# Altium schematic sheet STEP_DOWN.SchDoc: =DocumentName
size A4; ENG_APP_DATE: --/--/--; DSN_APP_DATE: --/--/--; CHK_APP_DATE: --/--/--; CompanyName: "AS Manufacturing" LLC; Organization: "AS Manufacturing" LLC; Address1: 5 Sklyarenka St.; Address2: Kyiv 04073; Address3: Ukraine; Address4: https://ajax.systems/en/; SheetNumber: 2; SheetTotal: 10; Template_version: 1.0.1
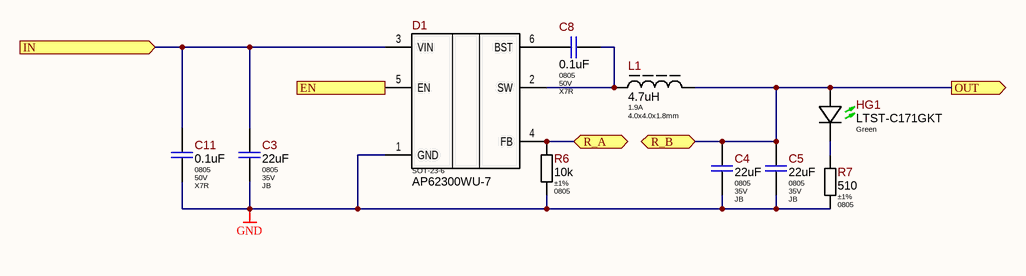
[diagram p0: STEP_DOWN.SchDoc]

## Parts
C3  Package: 0805  Voltage: 35V  Dielectric Type: JB  [CAP-0805(2012)X125T20]  (hidden comment: 22uF)
C4  Package: 0805  Voltage: 35V  Dielectric Type: JB  [CAP-0805(2012)X125T20]  (hidden comment: 22uF)
C5  Package: 0805  Voltage: 35V  Dielectric Type: JB  [CAP-0805(2012)X125T20]  (hidden comment: 22uF)
C8  Package: 0805  Voltage: 50V  Dielectric Type: X7R  [CAP-0805(2012)X85T10]  (hidden comment: 0.1uF)
C11  Package: 0805  Voltage: 50V  Dielectric Type: X7R  [CAP-0805(2012)X85T10]  (hidden comment: 0.1uF)
D1  AP62300WU-7  [SOT-23-6]
HG1  Color: Green  [LTST-C171GKT]  (hidden comment: LTST-C171GKT)
L1  Current: 1.9A  Package: 4.0x4.0x1.8mm  [SRN4018-Series_1.8mm]  (hidden comment: 4.7uH)
R6  Tolerance: ±1%  Package: 0805  [R_ANY_CHIP_0805_MED]  (hidden comment: 10k)
R7  Tolerance: ±1%  Package: 0805  [R_ANY_CHIP_0805_MED]  (hidden comment: 510)

## Ports
EN (in), IN (in), OUT (out), R_A (bidir), R_B (bidir)

## Nets
GND: C3.2 C4.2 C5.2 C11.2 D1.1(GND) R6.2 R7.2
EN: D1.5(EN) ; port EN
IN: C3.1 C11.1 D1.3(VIN) ; port IN
OUT: C4.1 C5.1 HG1.AN(Anode) L1.2 ; port OUT, port R_B
R_A: D1.4(FB) R6.1 ; port R_A
NetC8_1: C8.1 D1.6(BST)
NetC8_2: C8.2 D1.2(SW) L1.1
NetHG1_CA: HG1.CA(Cathode) R7.1

## Notes on the sheet
- Title
- Product:
- Project:
- Size:
- Date:
- Variant:
- A4
- Authors:
- Time:
- Sheet
- of
- Revision:
- @Vitech_ua
- Commit:

## Library data of the parts
C3-C5 = C2012JB1V226M125AC: 22uF 35V JB ±20% 0805 Ceramic Capacitor RoHS; Manufacturer: TDK Corporation; Ajax_1C_ID: 32073; Ajax_1C_PN: 22uF 35V 20% 0805 TDK C2012JB1V226M125AC Ceramic Capacitors RoHS; Ajax_1С_Status: RND Only; Standard Lead Time: 30 Weeks; Component Status: Released; Replacement: NONE; GUID_1C: 562d6396-e930-11eb-ab74-0050569f2651; Value: 22uF; Part Number: C2012JB1V226M125AC; Part Type: Ceramic / JB / 0805; Component Type: SMD; Temperature Range: -25°C ~ 85°C; Tolerance: ±20%; ComponentLink1URL: https://product.tdk.com/info/en/catalog/datasheets/mlcc_commercial_general_en.pdf; Supplier 1: Mouser; Supplier Part Number 1: 810-C2012JB1V226M12C; Price: 0,567; ComponentLink1Description: Datasheet
C8 C11 = CL21B104KBCNNNC: 100nF 50V X7R ±10% 0805 Ceramic Capacitor RoHS; Manufacturer: Samsung Electro-Mechanics; Ajax_1C_ID: 1251; Ajax_1C_PN: 100nF 50V X7R 10% 0805 CL21B104KBCNNNC Ceramic Capacitor SMD RoHS; Ajax_1С_Status: Mass Production; Standard Lead Time: 22 Weeks; Component Status: Released; Replacement: NONE; GUID_1C: 2c368b99-dd41-11e0-af93-6c626deda1bb; Value: 0.1uF; Part Number: CL21B104KBCNNNC; Part Type: Ceramic / X7R / 0805; Component Type: SMD; Temperature Range: -55°C ~ 125°C; Tolerance: ±10%; ComponentLink1URL: https://media.digikey.com/pdf/Data%20Sheets/Samsung%20PDFs/CL_Series_MLCC_ds.pdf; Supplier 1: Digi-Key; Supplier Part Number 1: 1276-1003-2-ND; Price: 0,00700031; ComponentLink1Description: Datasheet
D1 = AP62300WU-7: 4.35V to 18V, 2A, High Efficiency Synchronous Step Down Converter, 500kHz, SOT-23-6; Manufacturer: Diodes Incorporated; Ajax_1С_Status: RND Only; Component Status: Released; Replacement: NONE; Part Type: Power / DC-DC / Buck; Component Type: SMD; Temperature Range: -40°C ~ 85°C; ComponentLink1Description: Datasheet; Package: SOT-23-6; Part Number: AP62300WU-7
HG1 = LTST-C171GKT: Low Power LED, Green 565nm, Clear, SMD 0805, Vf 2.1V - 2.6V, 5 ~ 12mcd @ 20 mA, 130°; Manufacturer: Lite-On Optoelectronics; Ajax_1C_ID: 30364; Ajax_1C_PN: LTST-C171GKT Green SMD LED 0805 12mcd 20mA 130deg RoHS; Ajax_1С_Status: RND Only; Component Status: Released; Replacement: NONE; GUID_1C: df39881f-c399-11eb-ab74-0050569f2651; Part Number: LTST-C171GKT; Part Type: LED / 0805; Component Type: SMD; Package: 0805; Wavelength: 565nm; Temperature Range: -55°C ~ 85°C; ComponentLink1URL: https://media.digikey.com/pdf/Data%20Sheets/Lite-On%20PDFs/LTST-C171GKT.pdf; Supplier 1: Digi-Key; Supplier Part Number 1: 160-1423-2-ND; Price: 0,0319; ComponentLink1Description: Datasheet
L1 = SRN4018-4R7M: 4.7uH Semi-Shielded Wirewound Inductor 1.9A 84mOhm Max; Manufacturer: Bourns Inc; Ajax_1C_ID: 20972; Ajax_1C_PN: 4.7uH SRN4018-4R7M SMD Индуктивность; Ajax_1С_Status: RND Only; Saturation Current: 2A; Tolerance: ±20%; Component Status: Released; Standard Lead Time: 42 Weeks; Replacement: NONE; GUID_1C: 7ba8f5fd-b629-11ea-ab61-0050569f2651; Value: 4.7uH; Part Number: SRN4018-4R7M; Part Type: Power / Ferrite Core; Component Type: SMD; Temperature Range: -25°C ~ 120°C; ComponentLink1URL: https://eu.mouser.com/datasheet/2/54/srn4018-1391320.pdf; Supplier 1: Mouser; Supplier Part Number 1: 652-SRN4018-4R7M; Price: 0,291; ComponentLink1Description: Datasheet
R6 = RC0805FR-0710K2L: 10 kOhms ±1%, 1/8W 0805 Thick Film Resistor; Manufacturer: Yageo; Ajax_1C_ID: 13943; Ajax_1C_PN: 10.2k 1% 0805 Resistors SMD RoHS; Ajax_1С_Status: Mass Production; Power Rating: 0.125W; Voltage: 150V; Component Status: Released; Temperature Stability: ±100ppm/°C; Replacement: NONE; GUID_1C: 8bc9d0ce-c58a-11e8-ab47-0050569f2651; Value: 10k; Part Number: RC0805FR-0710K2L; Component Type: SMD; Part Type: Thick Film; Temperature Range: -55°C ~ 155°C; ComponentLink1URL: https://eu.mouser.com/datasheet/2/447/PYu_RC_Group_51_RoHS_L_10-1664068.pdf; Supplier 1: Digi-Key; Supplier Part Number 1: 311-10.2KCRTR-ND; Price: 0,0014; ComponentLink1Description: Datasheet
R7 = ERJ-P06F5100V: 510 Ohms ±1%, 1/2W 0805 High Power Thick Film Resistor; Manufacturer: Panasonic; Ajax_1C_ID: 15765; Ajax_1C_PN: 510R 1% 0.5W 0805 Panasonic ERJ-P06F5100V Resistors SMD RoHS; Ajax_1С_Status: RND Only; Power Rating: 0.5W; Voltage: 400V; Component Status: Released; Temperature Stability: ±100ppm/°C; Replacement: NONE; GUID_1C: 3592f296-62b5-11e9-ab4f-0050569f2651; Value: 510; Part Number: ERJ-P06F5100V; Component Type: SMD; Part Type: Thick Film / Anti-Surge/Pulse Withstanding; Temperature Range: -55°C ~ 155°C; ComponentLink1URL: https://eu.mouser.com/datasheet/2/315/AOA0000C331-1141874.pdf; Supplier 1: Mouser; Supplier Part Number 1: 667-ERJ-P06F5100V; Price: 0,036096; ComponentLink1Description: Datasheet